# Altium project DE-120824.PrjPcb
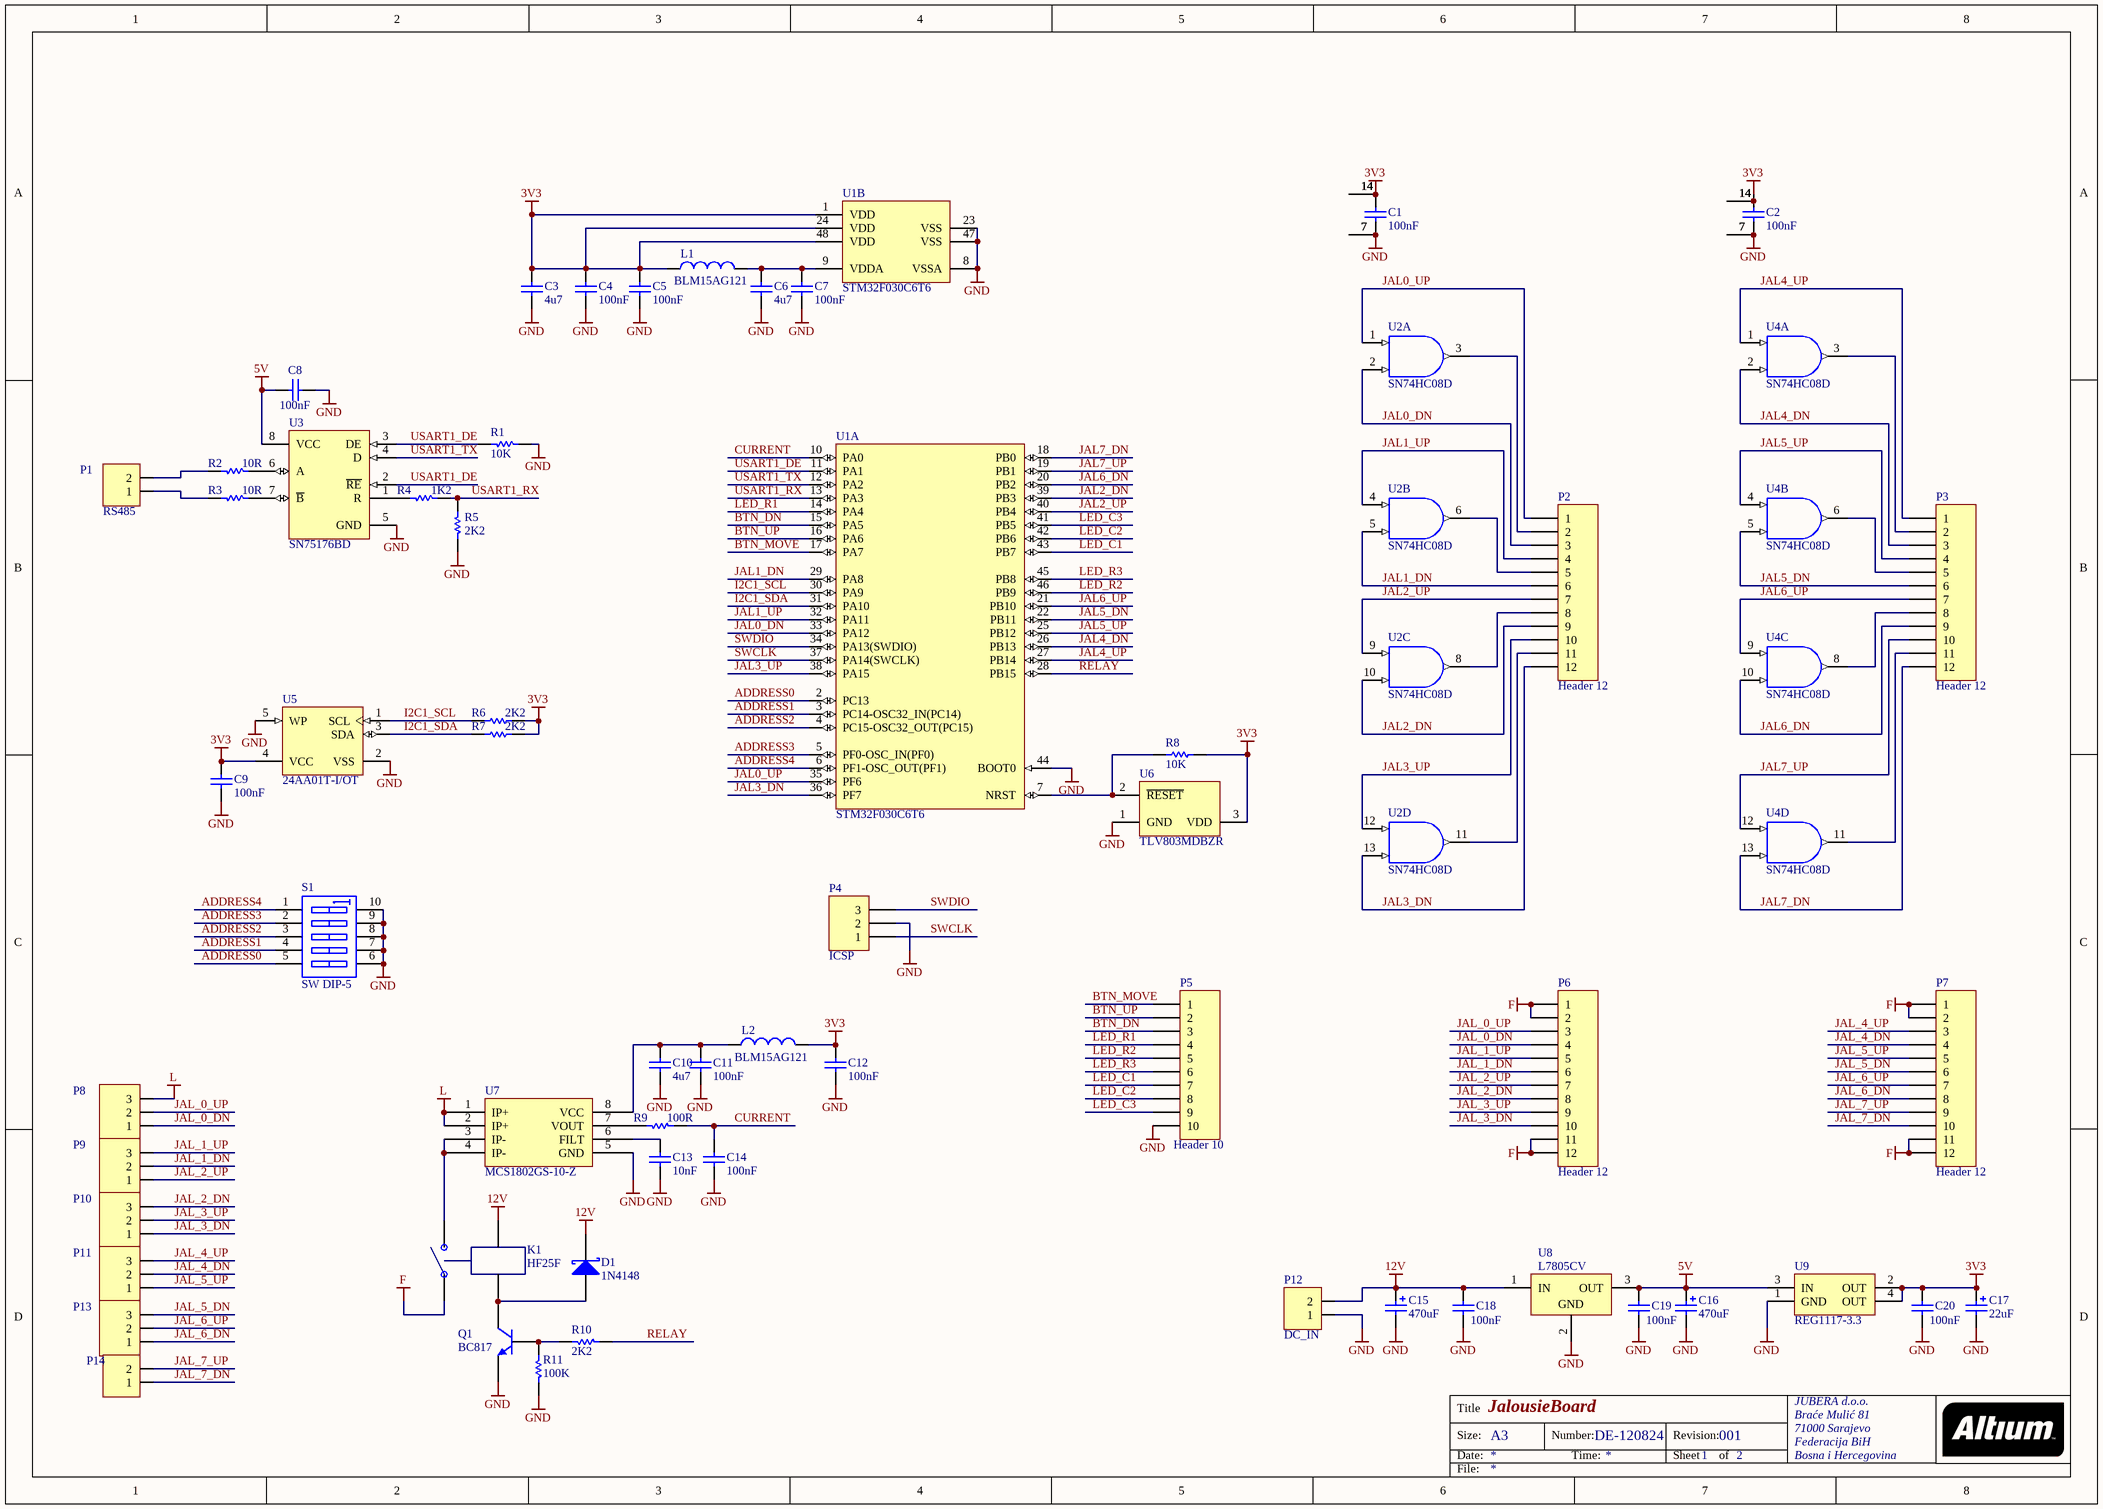
[diagram p0: DE-120824.SchDoc]
2 sheets, 163 parts. Net scope: global (net labels, ports and power ports of the same name join across sheets).
Board files: DE-120824.PcbDoc, DE-120824_1.PcbDoc
Sheets:
  DE-120824.SchDoc
  DE-120824_01.SchDoc

## Sheet DE-120824.SchDoc: JalousieBoard
size A3; Author: eldar6776@hotmail.com; DrawnBy: Eldar Dedic; Organization: JUBERA d.o.o.; Address1: Braće Mulić 81; Address2: 71000 Sarajevo; Address3: Federacija BiH; Address4: Bosna i Hercegovina; DocumentNumber: DE-120824; Revision: 001; SheetNumber: 1; SheetTotal: 2

### Parts
C1  value 100nF  [0603]  (hidden comment: C0603)
C2  value 100nF  [0603]  (hidden comment: C0603)
C3  value 4u7  [0805]  (hidden comment: C0805)
C4  value 100nF  [0603]  (hidden comment: C0603)
C5  value 100nF  [0603]  (hidden comment: C0603)
C6  value 4u7  [0805]  (hidden comment: C0805)
C7  value 100nF  [0603]  (hidden comment: C0603)
C8  100nF  [0603]
C9  value 100nF  [0603]  (hidden comment: C0603)
C10  value 4u7  [0805]  (hidden comment: C0805)
C11  value 100nF  [0603]  (hidden comment: C0603)
C12  value 100nF  [0603]  (hidden comment: C0603)
C13  value 10nF  [0603]  (hidden comment: C0603)
C14  value 100nF  [0603]  (hidden comment: C0603)
C15  470uF  [CAPPR5-10X12.5]
C16  470uF  [CAPPR5-10X12.5]
C17  22uF  [CAPPR2-5X11]
C18  100nF  [0603]
C19  100nF  [0603]
C20  100nF  [0603]
D1  1N4148  [SOD323]
K1  HF25F  [HF25F]
L1  BLM15AG121  [0402-A]
L2  BLM15AG121  [0402-A]
P1  RS485  [TERMINAL BLOK 2]
P2  Header 12  [HDR1X12]
P3  Header 12  [HDR1X12]
P4  ICSP  [HDR1X3]
P5  Header 10  [HDR1X10]
P6  Header 12  [HDR1X12]
P7  Header 12  [HDR1X12]
P8  (no value)  [TERMINAL BLOK 3]
P9  (no value)  [TERMINAL BLOK 3]
P10  (no value)  [TERMINAL BLOK 3]
P11  (no value)  [TERMINAL BLOK 3]
P12  DC_IN  [TERMINAL BLOK 2]
P13  (no value)  [TERMINAL BLOK 3]
P14  (no value)  [TERMINAL BLOK 2]
Q1  BC817  [SOT23_N]
R1  10K  [ERA-0603]
R2  10R  [ERA-0603]
R3  10R  [ERA-0603]
R4  1K2  [ERA-0603]
R5  2K2  [ERA-0603]
R6  2K2  [ERA-0603]
R7  2K2  [ERA-0603]
R8  10K  [ERA-0603]
R9  100R  [ERA-0603]
R10  2K2  [ERA-0603]
R11  100K  [ERA-0603]
S1  SW DIP-5  [N10A]
U1  STM32F030C6T6  [STM-LQFP48_N]  (parts A,B of 2)
U2  SN74HC08D  [D014_N]  (parts A,B,C,D of 4)
U3  SN75176BD  [D008_N]
U4  SN74HC08D  [D014_N]  (parts A,B,C,D of 4)
U5  24AA01T-I/OT  [SOT-23-OT5_N]
U6  TLV803MDBZR  [DBZ3_N]
U7  MCS1802GS-10-Z  [SOIC-SN8_N]
U8  L7805CV  [TO220]
U9  REG1117-3.3  [ZZ311]

### Nets
3V3: C1.1 C2.1 C3.2 C4.2 C5.2 C9.2 C12.2 C17.1 C20.2 L1.1 L2.2 R6.2 R7.2 R8.2 U1.1(VDD) U1.24(VDD) U1.48(VDD) U2.14(3V3) U5.4(VCC) U6.3(VDD) U9.2(OUT) U9.4(OUT)
5V: C8.1 C16.1 C19.2 U3.8(VCC) U8.3(OUT) U9.3(IN)
12V: C15.1 C18.2 D1.1(K) K1.2 P12.2 U8.1(IN)
F: K1.3 P6.1 P6.2 P6.11 P6.12 P7.1 P7.2 P7.11 P7.12
GND: C1.2 C2.2 C3.1 C4.1 C5.1 C6.1 C7.1 C8.2 C9.1 C10.1 C11.1 C12.1 C13.1 C14.1 C15.2 C16.2 C17.2 C18.1 C19.1 C20.1 P4.2 P5.10 P12.1 Q1.2(E) R1.1 R5.2 R11.1 S1.6(B5) S1.7(B4) S1.8(B3) S1.9(B2) S1.10(B1) U1.8(VSSA) U1.23(VSS) U1.44(BOOT0) U1.47(VSS) U2.7(GND) U3.5(GND) U4.7(GND) U5.2(VSS) U5.5(WP) U6.1(GND) U7.5(GND) U8.2(GND) U9.1(GND)
L: P8.3 U7.1(IP+) U7.2(IP+)
ADDRESS0: S1.5(A5) U1.2(PC13)
ADDRESS1: S1.4(A4) U1.3(PC14-OSC32_IN(PC14))
ADDRESS2: S1.3(A3) U1.4(PC15-OSC32_OUT(PC15))
ADDRESS3: S1.2(A2) U1.5(PF0-OSC_IN(PF0))
ADDRESS4: S1.1(A1) U1.6(PF1-OSC_OUT(PF1))
BTN_DN: P5.3 U1.15(PA5)
BTN_MOVE: P5.1 U1.17(PA7)
BTN_UP: P5.2 U1.16(PA6)
CURRENT: C14.2 R9.1 U1.10(PA0)
I2C1_SCL: R6.1 U1.30(PA9) U5.1(SCL)
I2C1_SDA: R7.1 U1.31(PA10) U5.3(SDA)
JAL0_DN: P2.3 U1.33(PA12) U2.2(B)
JAL0_UP: P2.1 U1.35(PF6) U2.1(A)
JAL1_DN: P2.6 U1.29(PA8) U2.5(B)
JAL1_UP: P2.4 U1.32(PA11) U2.4(A)
JAL2_DN: P2.9 U1.39(PB3) U2.10(B)
JAL2_UP: P2.7 U1.40(PB4) U2.9(A)
JAL3_DN: P2.12 U1.36(PF7) U2.13(B)
JAL3_UP: P2.10 U1.38(PA15) U2.12(A)
JAL4_DN: P3.3 U1.26(PB13) U4.2(B)
JAL4_UP: P3.1 U1.27(PB14) U4.1(A)
JAL5_DN: P3.6 U1.22(PB11) U4.5(B)
JAL5_UP: P3.4 U1.25(PB12) U4.4(A)
JAL6_DN: P3.9 U1.20(PB2) U4.10(B)
JAL6_UP: P3.7 U1.21(PB10) U4.9(A)
JAL7_DN: P3.12 U1.18(PB0) U4.13(B)
JAL7_UP: P3.10 U1.19(PB1) U4.12(A)
JAL_0_DN: P6.4 P8.1
JAL_0_UP: P6.3 P8.2
JAL_1_DN: P6.6 P9.2
JAL_1_UP: P6.5 P9.3
JAL_2_DN: P6.8 P10.3
JAL_2_UP: P6.7 P9.1
JAL_3_DN: P6.10 P10.1
JAL_3_UP: P6.9 P10.2
JAL_4_DN: P7.4 P11.2
JAL_4_UP: P7.3 P11.3
JAL_5_DN: P7.6 P13.3
JAL_5_UP: P7.5 P11.1
JAL_6_DN: P7.8 P13.1
JAL_6_UP: P7.7 P13.2
JAL_7_DN: P7.10 P14.1
JAL_7_UP: P7.9 P14.2
LED_C1: P5.7 U1.43(PB7)
LED_C2: P5.8 U1.42(PB6)
LED_C3: P5.9 U1.41(PB5)
LED_R1: P5.4 U1.14(PA4)
LED_R2: P5.5 U1.46(PB9)
LED_R3: P5.6 U1.45(PB8)
RELAY: R10.2 U1.28(PB15)
SWCLK: P4.1 U1.37(PA14(SWCLK))
SWDIO: P4.3 U1.34(PA13(SWDIO))
USART1_DE: R1.2 U1.11(PA1) U3.2(~{RE}) U3.3(DE)
USART1_RX: R4.1 R5.1 U1.13(PA3)
USART1_TX: U1.12(PA2) U3.4(D)
NetC6_2: C6.2 C7.2 L1.2 U1.9(VDDA)
NetC10_2: C10.2 C11.2 L2.1 U7.8(VCC)
NetC13_2: C13.2 U7.6(FILT)
NetD1_2: D1.2(A) K1.1 Q1.3(C)
NetK1_4: K1.4 U7.3(IP-) U7.4(IP-)
NetP1_1: P1.1 R3.1
NetP1_2: P1.2 R2.1
NetP2_2: P2.2 U2.3(Y)
NetP2_5: P2.5 U2.6(Y)
NetP2_8: P2.8 U2.8(Y)
NetP2_11: P2.11 U2.11(Y)
NetP3_2: P3.2 U4.3(Y)
NetP3_5: P3.5 U4.6(Y)
NetP3_8: P3.8 U4.8(Y)
NetP3_11: P3.11 U4.11(Y)
NetQ1_1: Q1.1(B) R10.1 R11.2
NetR2_2: R2.2 U3.6(A)
NetR3_2: R3.2 U3.7(~{B})
NetR4_2: R4.2 U3.1(R)
NetR8_1: R8.1 U1.7(NRST) U6.2(~{RESET})
NetR9_2: R9.2 U7.7(VOUT)

Not connected (* = marked no-connect by the designer): U4 14(3V3)

### Notes on the sheet
- Title
- Size:
- Date:
- A3
- Number:
- Time:
- Revision:
- Sheet
- of
- File:

### Library data of the parts
C1 C2 C4 C5 C7-C9 C11-C14 C18-C20 = C0603: Ceramic Chip Capacitor - Standard; Note: Footprint corresponds to dimensions for bulk cassette packaging. This case size has tightened tolerances.; Published: 17-Jul-2002; LatestRevisionDate: 19-Mar-2004; LatestRevisionNote: Silkscreen size reduced.; DatasheetDocument: Mar-2001; PackageDocument: Mar-2001; PackageReference: 0603; Publisher: Altium Limited; Code_JEITA: 0603; Code_IPC: 1608 [0603]; ComponentLink1Description: Manufacturer Link; ComponentLink1URL: http://www.kemet.com/; ComponentLink2Description: Datasheet; ComponentLink2URL: http://www.kemet.com/kemet/web/homepage/kechome.nsf/vapubfilesname/F3102TA.pdf/$file/F3102TA.pdf
  C8 C18-C20: Value: 100nF
C3 C6 C10 = C0805: Ceramic Chip Capacitor - Standard; Note: Footprint corresponds to dimensions for bulk cassette packaging. This case size has tightened tolerances.; Published: 17-Jul-2002; LatestRevisionDate: 19-Mar-2004; LatestRevisionNote: Silkscreen size reduced.; DatasheetDocument: Mar-2001; PackageDocument: Mar-2001; PackageReference: 0805; Publisher: Altium Limited; Code_JEITA: 0805; Code_IPC: 2012[0805]; ComponentLink1Description: Manufacturer Link; ComponentLink1URL: http://www.kemet.com/; ComponentLink2Description: Datasheet; ComponentLink2URL: http://www.kemet.com/kemet/web/homepage/kechome.nsf/vapubfilesname/F3102TA.pdf/$file/F3102TA.pdf
C15 C16 = EKA00DC347E00: Aluminum Electrolytic Capacitor, Radial Style with Long Leads: 470uF, 25V; Note: Refer to Manufacturer's Data Sheets for other lead formations; DrillSize: Nominal, Rounded To The Nearest 0.1mm; Published: 19-Mar-2004; DatasheetDocument: 20-Feb-2001; PackageReference: CAPPR5-10X12.5; Publisher: Altium Limited; ComponentLink1Description: Manufacturer Link; ComponentLink1URL: http://www.vishay.com/; ComponentLink2Description: Datasheet; ComponentLink2URL: http://www.vishay.com/docs/25014/eka.pdf; Value: 470uF
C17 = EKA00AA247F00: Aluminum Electrolytic Capacitor, Radial Style with Long Leads: 47uF, 35V; Note: Refer to Manufacturer's Data Sheets for other lead formations; DrillSize: Nominal, Rounded To The Nearest 0.1mm; Published: 19-Mar-2004; DatasheetDocument: 20-Feb-2001; PackageReference: CAPPR2-5X11; Publisher: Altium Limited; ComponentLink1Description: Manufacturer Link; ComponentLink1URL: http://www.vishay.com/; ComponentLink2Description: Datasheet; ComponentLink2URL: http://www.vishay.com/docs/25014/eka.pdf; Value: 47uF
D1 = 1PS76SB10: Schottky Barrier Diode; Published: 17-Sep-2003; LatestRevisionDate: 19-Mar-2004; LatestRevisionNote: Silkscreen size reduced.; DatasheetVersion: 14-Oct-1996; PackageVersion: May-1999; PackageReference: SOD323; Publisher: Altium Limited; PackageDescription: SOD-323/SC-76; 2 Leads; Body 1.7 x 1.3 mm, (LxW); ComponentLink1Description: Manufacturer Link; ComponentLink1URL: http://www.semiconductors.philips.com/; ComponentLink2Description: Datasheet; ComponentLink2URL: http://www.semiconductors.philips.com/acrobat/datasheets/1PS76SB10_2.pdf
K1 = HF25F: PCB relay 250VAC/20A 30VDC/16A
L1 L2 = Chip inductor: SMD chip inductor; Code_IEC: 1005; Published: 8-Jun-2000; LatestRevisionDate: 29-May-2009; LatestRevisionNote: IPC-7351 Footprint Added.; PackageReference: 0402-A; Publisher: Altium Limited; PackageDescription: Chip Inductor; Code_JEITA: 0402
P1 P12 P14 = TERMINAL BLOK 2: Terminal blok konektor 3,5 mm
P2 P3 P6 P7 = Header 12: Header, 12-Pin; LatestRevisionDate: 17-Jul-2002; LatestRevisionNote: Re-released for DXP Platform.; Publisher: Altium Limited
P4 = Header 3: Header, 3-Pin; LatestRevisionDate: 17-Jul-2002; LatestRevisionNote: Re-released for DXP Platform.; Publisher: Altium Limited
P5 = Header 10: Header, 10-Pin; LatestRevisionDate: 17-Jul-2002; LatestRevisionNote: Re-released for DXP Platform.; Publisher: Altium Limited
P8-P11 P13 = TERMINAL BLOK 3: 3 pinski terminal blok konektor
Q1 = BC817: NPN General-purpose Transistor; Published: 17-Sep-2003; LatestRevisionDate: 12-Dec-2006; LatestRevisionNote: IPC-7351 Footprint Added.; DatasheetVersion: Jun-1999; PackageVersion: May-1999; PackageReference: SOT23; Publisher: Altium Limited; PackageDescription: 3-Pin SOT-23 Package 0.95 mm Pitch, 2.3 mm Lead Span; ComponentLink1Description: Manufacturer Link; ComponentLink1URL: http://www.semiconductors.philips.com/; ComponentLink2Description: Datasheet; ComponentLink2URL: http://www.semiconductors.philips.com/acrobat/datasheets/BC817_BC817W_BC337_5.pdf
R1-R5 R9-R11 = ERAV: Metal Film Thermosensitive Chip Resistor, 0.56 Ohm to 10k Ohm Range, 5% Tolerance, 0603 Size, 0.063 W; Note: If flow soldering, adjust pad width of PCB Footprint to 0.7 - 0.8 times the width of the resistor.; Published: 17-Dec-2003; LatestRevisionDate: 19-Mar-2004; LatestRevisionNote: Silkscreen size reduced.; PackageDocument: Mar-2003; PackageReference: ERA-0603; Publisher: Altium Limited; Code_IPC: 1608 [0603]; ComponentLink1Description: Manufacturer Link; ComponentLink1URL: http://www.panasonic.com/industrial/components/resistive_products.htm; ComponentLink2Description: Datasheet; ComponentLink2URL: http://www.panasonic.com/industrial/components/pdf/AOF0000CE1.pdf
R6-R8 = ERA3Y: Rectangular Thick Film Chip Resistor, 10 Ohm to 330k Ohm Range, 0.1% and 0.5% Tolerance, 0603 Size, 0.063 W; Note: If flow soldering, adjust pad width of PCB Footprint to 0.7 - 0.8 times the width of the resistor.; Published: 17-Dec-2003; LatestRevisionDate: 19-Mar-2004; LatestRevisionNote: Silkscreen size reduced.; PackageDocument: Mar-2003; PackageReference: ERA-0603; Publisher: Altium Limited; Code_IPC: 1608 [0603]; ComponentLink1Description: Manufacturer Link; ComponentLink1URL: http://www.panasonic.com/industrial/components/resistive_products.htm; ComponentLink2Description: Datasheet; ComponentLink2URL: http://www.panasonic.com/industrial/components/pdf/AOA0000CE8.pdf
S1 = SW DIP-5: DIP Switch, 5 Position, SPST; Published: 24-Mar-1999; LatestRevisionDate: 17-Jul-2002; LatestRevisionNote: Re-released for DXP Platform.; PackageReference: N10A; Publisher: Altium Limited
U1 = STM32F030C6T6: ARM Cortex-M0 32-bit MCU, 32 KB Flash, 4 KB Internal RAM, 39 I/Os, 48-pin LQFP, -40 to 85 degC, Tray; FLASH Size (Prog) (kB): 32; I/Os (High Current): 39; Internal RAM Size (kB): 4; Operating Frequency(F) (Processor speed) (MHz): 48; Supply Voltage(Vcc) min (V): 2.4; DatasheetVersion: Rev. 1; PackageVersion: Rev. 6, 06/2013; PackageReference: LQFP48; PackageDescription: 48-Pin Low Profile Quad Flat Package, 7 x 7 mm Body, 0.5 mm Pitch; Supplier 1: Digi-Key; Supplier Part Number 1: 497-14042-ND; Supplier 2: Newark; Supplier Part Number 2: 06X3646; Supplier 3: Mouser; Supplier Part Number 3: 511-STM32F030C6T6; Core: ARM Cortex-M0; Packing: Tray; Mounting Technology: Surface Mount; PartNumber: STM32F030C6T6; ComponentLink1Description: Manufacturer URL; ComponentLink1URL: http://www.st.com/web/en/home.html; ComponentLink2Description: Datasheet; ComponentLink2URL: http://www.st.com/st-web-ui/static/active/en/resource/technical/document/datasheet/DM00088500.pdf; ComponentLink3Description: Package Specification; ComponentLink3URL: http://www.st.com/st-web-ui/static/active/en/resource/technical/document/datasheet/DM00058181.pdf
U2 U4 = SN74HC08D: Quadruple 2-Input Positive-AND Gate; Published: 8-Jun-2000; LatestRevisionDate: 13-Apr-2006; LatestRevisionNote: IPC-7351 Footprint Added.; DatasheetVersion: May-1997; PackageVersion: Jan-1998; PackageReference: D014; Publisher: Altium Limited; PackageDescription: 14-Pin Small Outline Integrated Circuit 1.27 mm Pitch; Code_IPC: SOIC127P600-14; ComponentLink1Description: Manufacturer Link; ComponentLink1URL: http://www.ti.com/; ComponentLink2Description: Datasheet; ComponentLink2URL: http://www-s.ti.com/sc/ds/SN74HC08.pdf
U3 = SN75176BD: Differential Bus Transceiver; Note: Receiver Hysteresis of 50mV Typical; Published: 15-May-2002; LatestRevisionDate: 13-Apr-2006; LatestRevisionNote: IPC-7351 Footprint Added.; DatasheetVersion: Sep-1989; PackageVersion: Jan-1998; PackageReference: D008; Publisher: Altium Limited; PackageDescription: 8-Pin Small Outline Integrated Circuit 1.27 mm Pitch; Code_IPC: SOIC127P600-8; ComponentLink1Description: Manufacturer Link; ComponentLink1URL: http://www.ti.com/; ComponentLink2Description: Datasheet; ComponentLink2URL: http://www-s.ti.com/sc/ds/sn75176b.pdf
U5 = 24AA01T-I/OT: 1Kbit, 400kHz, 1.8V, I2C Serial EEPROM, 5-Pin SOT-23, Industrial Temperature, Tape and Reel; Published: 29-Jan-2009; DatasheetVersion: revJ, Jan-2009; PackageVersion: revBB, Aug-2009; PackageReference: SOT-23-OT5; Publisher: Altium Limited; PackageDescription: 5-Lead Plastic Small Outline Transistor (OT) [SOT-23]; Supplier 1: Digi-Key; Supplier Part Number 1: 24AA01T-I/OTTR-ND; Supplier 2: Digi-Key; Supplier Part Number 2: 24AA01T-I/OTCT-ND; Supplier 3: Digi-Key; Supplier Part Number 3: 24AA01T-I/OTDKR-ND; Supplier 4: Farnell; Supplier Part Number 4: 1331269; Code_IPC: SOT23-5; ComponentLink1Description: Datasheet; ComponentLink1URL: http://ww1.microchip.com/downloads/en/DeviceDoc/21711J.pdf; ComponentLink2Description: Packaging Specification; ComponentLink2URL: http://www.microchip.com/stellent/groups/techpub_sg/documents/packagingspec/en012702.pdf; ComponentLink3Description: Microchip.com Home; ComponentLink3URL: http://www.microchip.com/
U6 = TLV803MDBZR: Voltage Supervisor with Active-Low, Open Drain Reset, 1 Supply Monitored, -40 to 125 degC, 3-pin SOT-23 (DBZ), Green (RoHS & no Sb/Br); Manufacturer: Texas Instruments; # of supplies monitored: 1; Iq(Typ)(uA): 9; Output Driver Type / Reset Output: Active-low, Open-drain; Rating: Catalog; Reset Threshold Accuracy(%): 2; SubFamily: Supervisor and Reset IC; Threshold Voltage 1 (typ)(Typ)(V): 4.38; Time Delay(ms): 200; VCC(Max)(V): 6; VCC(Min)(V): 1.1; DatasheetVersion: SBVS157B; PackageVersion: revB, Apr-2005; PackageReference: DBZ3; PackageDescription: 3-Pin Plastic Small-Outline Package, 0.95 mm Pitch, 2.4 mm Lead Span; Supplier 1: Digi-Key; Supplier Part Number 1: 296-29194-2-ND; Supplier 2: Digi-Key; Supplier Part Number 2: 296-29194-1-ND; Supplier 3: Digi-Key; Supplier Part Number 3: 296-29194-6-ND; Supplier 4: Newark; Supplier Part Number 4: 58T0286; Supplier 5: Mouser; Supplier Part Number 5: 595-TLV803MDBZR; Mounting Technology: Surface Mount; Code_JEDEC: TO-236-AB; PartNumber: TLV803MDBZR; ComponentLink1Description: Datasheet; ComponentLink1URL: http://www.ti.com/general/docs/lit/getliterature.tsp?genericPartNumber=TLV803M&fileType=pdf
U7 = ACS71240
U8 = L7805CV: Positive Voltage Regulator, 5V, 3-Pin TO-220; DatasheetVersion: Nov-2011; PackageVersion: ver3.0; PackageReference: TO220; PackageDescription: TO, Thru-Hole, Vertical, Heatsink Mounted; 3 In-Line Leads; Pitch 2.54 mm; PartNumber: L7805CV; ComponentLink1Description: Manufacturer URL; ComponentLink1URL: http://www.st.com; ComponentLink2Description: Datasheet; ComponentLink2URL: http://www.st.com/internet/com/TECHNICAL_RESOURCES/TECHNICAL_LITERATURE/DATASHEET/CD00000444.pdf; ComponentLink3Description: Package Specification; ComponentLink3URL: http://www.st.com/internet/com/TECHNICAL_RESOURCES/TECHNICAL_LITERATURE/PACKAGE_INFORMATION/CD00004649.pdf
U9 = REG1117-3.3: 800mA and 1A Low Dropout Positive Regulator 2.85V, 3.3V, 5V, and Adjustable; Published: 8-Jun-2000; LatestRevisionDate: 17-Jul-2002; LatestRevisionNote: Re-released for DXP Platform.; DatasheetVersion: Sep-1997; PackageVersion: revC; PackageReference: ZZ311; Publisher: Altium Limited; PackageDescription: SOT-223/SC-73; 4 Leads; Body 6.7 x 7.3 mm, inc. leads (LxW max); ComponentLink1Description: Manufacturer Link; ComponentLink1URL: http://www.ti.com/; ComponentLink2Description: Datasheet; ComponentLink2URL: http://www-s.ti.com/sc/ds/REG1117.pdf

## Sheet DE-120824_01.SchDoc: JalousieBoard
size A3; Author: eldar6776@hotmail.com; DrawnBy: Eldar Dedic; Organization: JUBERA d.o.o.; Address1: Braće Mulić 81; Address2: 71000 Sarajevo; Address3: Federacija BiH; Address4: Bosna i Hercegovina; DocumentNumber: DE-120824; Revision: 001; SheetNumber: 1; SheetTotal: 2
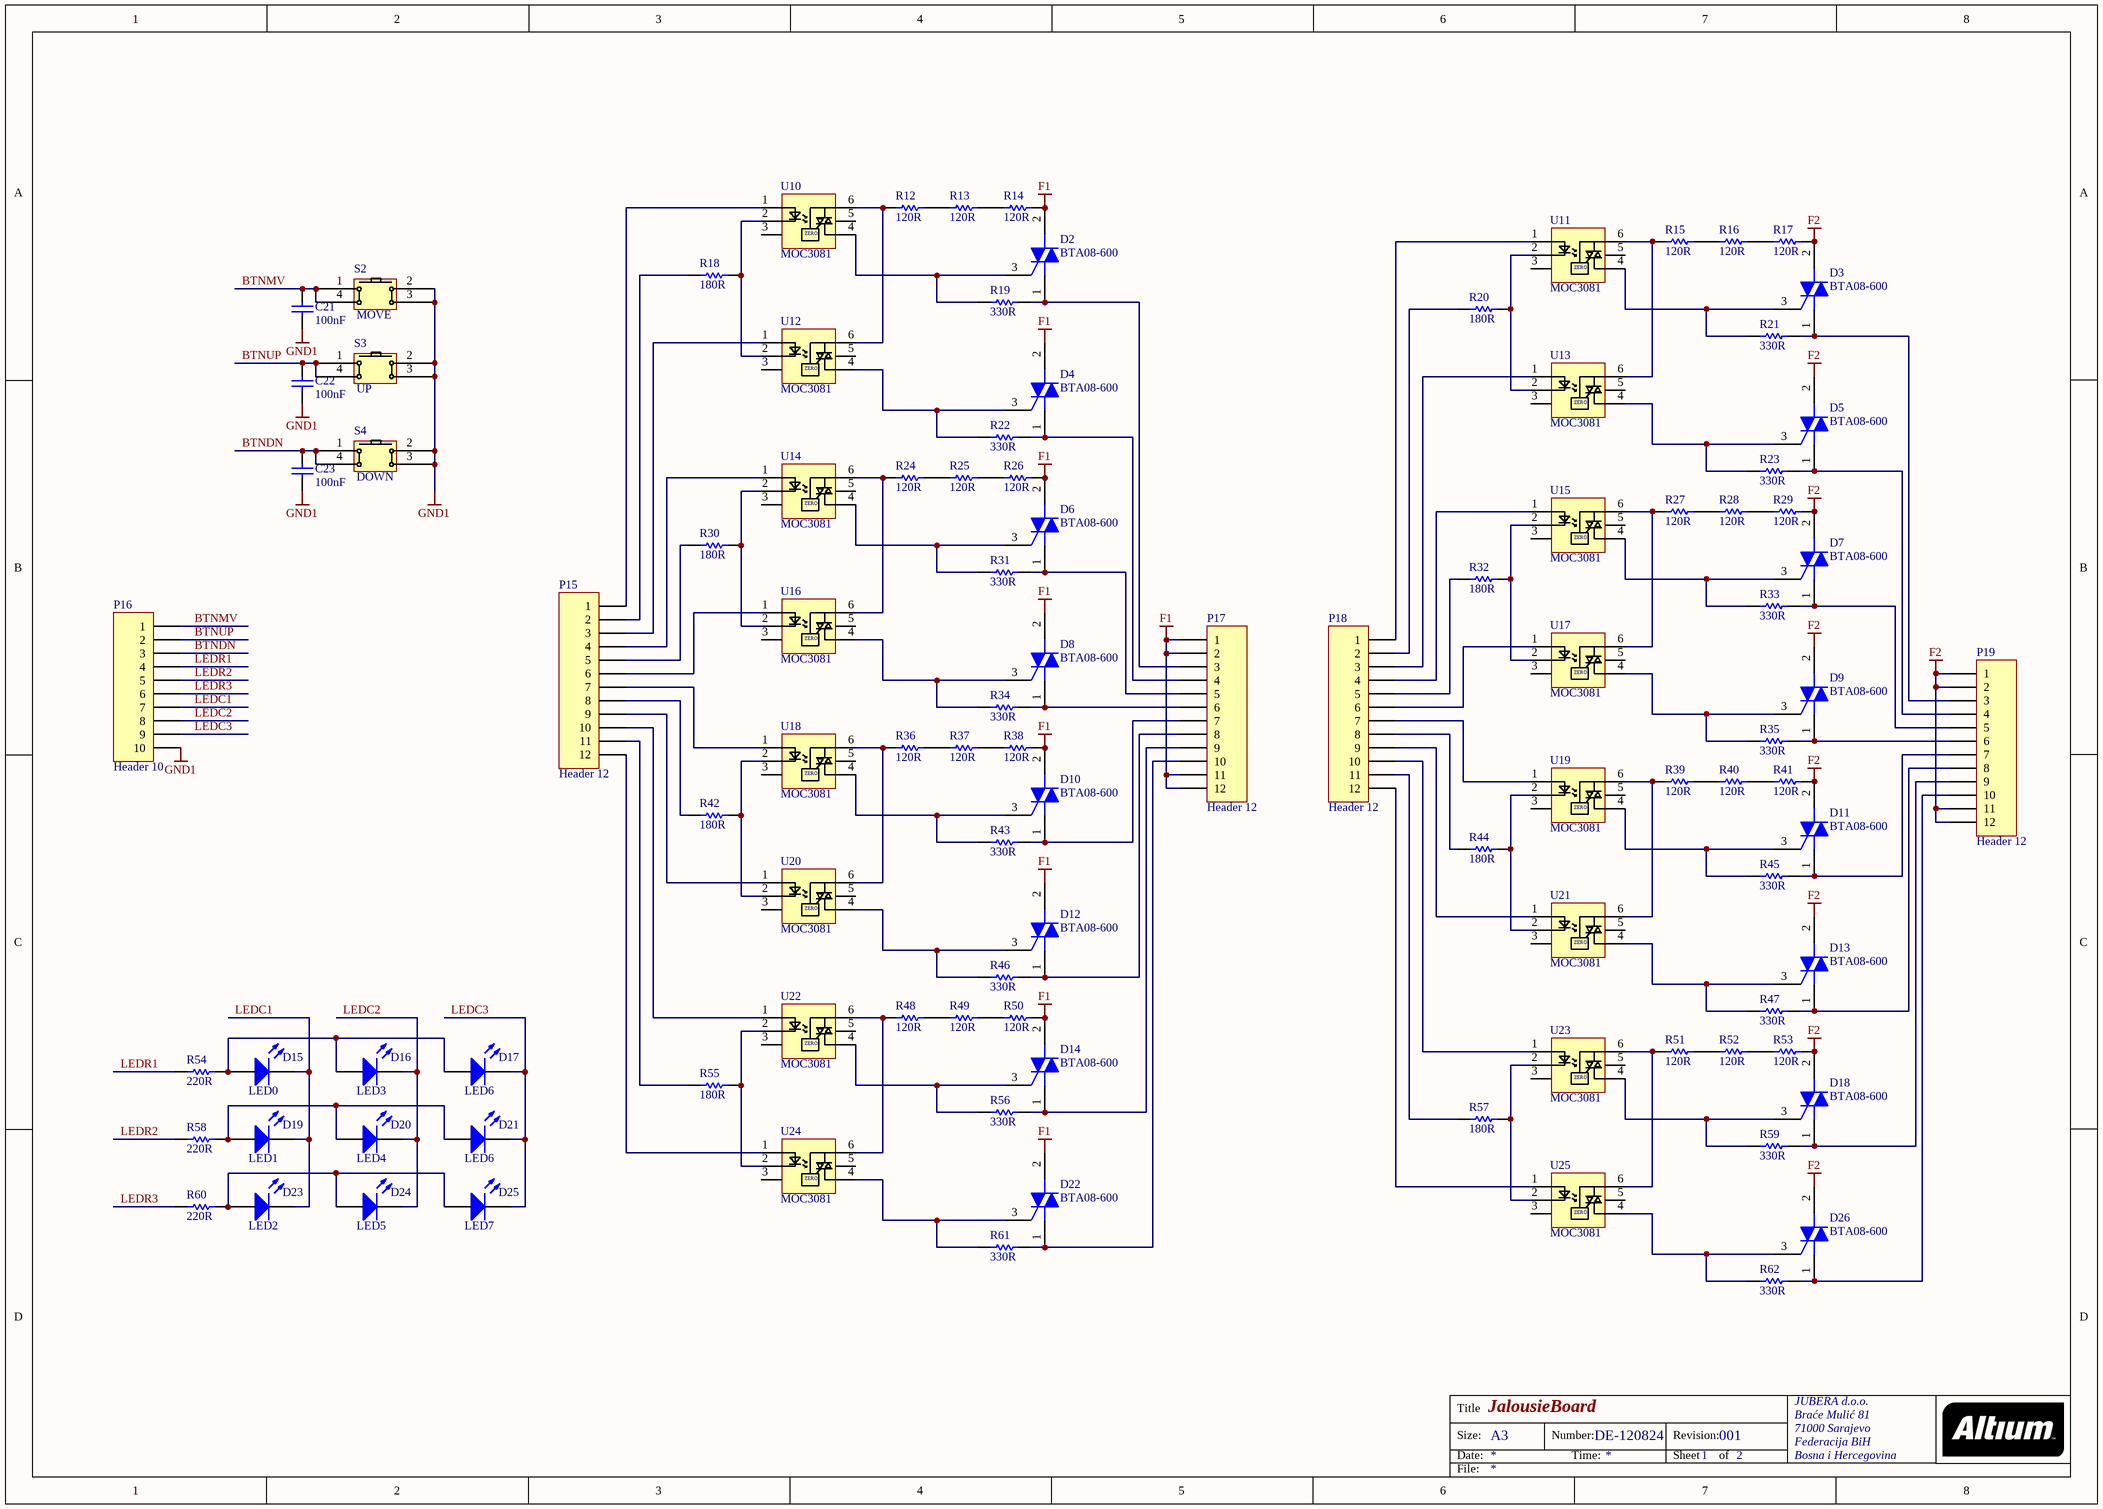
[diagram p1: DE-120824_01.SchDoc]

### Parts
C21  value 100nF  [0603]  (hidden comment: C0603)
C22  value 100nF  [0603]  (hidden comment: C0603)
C23  value 100nF  [0603]  (hidden comment: C0603)
D2  BTA08-600  [ONSC-TO-220-3-221A-07]
D3  BTA08-600  [ONSC-TO-220-3-221A-07]
D4  BTA08-600  [ONSC-TO-220-3-221A-07]
D5  BTA08-600  [ONSC-TO-220-3-221A-07]
D6  BTA08-600  [ONSC-TO-220-3-221A-07]
D7  BTA08-600  [ONSC-TO-220-3-221A-07]
D8  BTA08-600  [ONSC-TO-220-3-221A-07]
D9  BTA08-600  [ONSC-TO-220-3-221A-07]
D10  BTA08-600  [ONSC-TO-220-3-221A-07]
D11  BTA08-600  [ONSC-TO-220-3-221A-07]
D12  BTA08-600  [ONSC-TO-220-3-221A-07]
D13  BTA08-600  [ONSC-TO-220-3-221A-07]
D14  BTA08-600  [ONSC-TO-220-3-221A-07]
D15  LED0  [1.6X0.8X0.8]
D16  LED3  [1.6X0.8X0.8]
D17  LED6  [1.6X0.8X0.8]
D18  BTA08-600  [ONSC-TO-220-3-221A-07]
D19  LED1  [1.6X0.8X0.8]
D20  LED4  [1.6X0.8X0.8]
D21  LED6  [1.6X0.8X0.8]
D22  BTA08-600  [ONSC-TO-220-3-221A-07]
D23  LED2  [1.6X0.8X0.8]
D24  LED5  [1.6X0.8X0.8]
D25  LED7  [1.6X0.8X0.8]
D26  BTA08-600  [ONSC-TO-220-3-221A-07]
P15  Header 12  [HDR1X12]
P16  Header 10  [HDR1X10]
P17  Header 12  [HDR1X12]
P18  Header 12  [HDR1X12]
P19  Header 12  [HDR1X12]
R12  120R  [ERA-0805]
R13  120R  [ERA-0805]
R14  120R  [ERA-0805]
R15  120R  [ERA-0805]
R16  120R  [ERA-0805]
R17  120R  [ERA-0805]
R18  180R  [ERA-0603]
R19  330R  [ERA-0805]
R20  180R  [ERA-0603]
R21  330R  [ERA-0805]
R22  330R  [ERA-0805]
R23  330R  [ERA-0805]
R24  120R  [ERA-0805]
R25  120R  [ERA-0805]
R26  120R  [ERA-0805]
R27  120R  [ERA-0805]
R28  120R  [ERA-0805]
R29  120R  [ERA-0805]
R30  180R  [ERA-0603]
R31  330R  [ERA-0805]
R32  180R  [ERA-0603]
R33  330R  [ERA-0805]
R34  330R  [ERA-0805]
R35  330R  [ERA-0805]
R36  120R  [ERA-0805]
R37  120R  [ERA-0805]
R38  120R  [ERA-0805]
R39  120R  [ERA-0805]
R40  120R  [ERA-0805]
R41  120R  [ERA-0805]
R42  180R  [ERA-0603]
R43  330R  [ERA-0805]
R44  180R  [ERA-0603]
R45  330R  [ERA-0805]
R46  330R  [ERA-0805]
R47  330R  [ERA-0805]
R48  120R  [ERA-0805]
R49  120R  [ERA-0805]
R50  120R  [ERA-0805]
R51  120R  [ERA-0805]
R52  120R  [ERA-0805]
R53  120R  [ERA-0805]
R54  220R  [ERA-0805]
R55  180R  [ERA-0603]
R56  330R  [ERA-0805]
R57  180R  [ERA-0603]
R58  220R  [ERA-0805]
R59  330R  [ERA-0805]
R60  220R  [ERA-0805]
R61  330R  [ERA-0805]
R62  330R  [ERA-0805]
S2  MOVE  [TACTILE_SWITCH]
S3  UP  [TACTILE_SWITCH]
S4  DOWN  [TACTILE_SWITCH]
U10  MOC3081  [DIP6]
U11  MOC3081  [DIP6]
U12  MOC3081  [DIP6]
U13  MOC3081  [DIP6]
U14  MOC3081  [DIP6]
U15  MOC3081  [DIP6]
U16  MOC3081  [DIP6]
U17  MOC3081  [DIP6]
U18  MOC3081  [DIP6]
U19  MOC3081  [DIP6]
U20  MOC3081  [DIP6]
U21  MOC3081  [DIP6]
U22  MOC3081  [DIP6]
U23  MOC3081  [DIP6]
U24  MOC3081  [DIP6]
U25  MOC3081  [DIP6]

### Nets
F1: D2.2(MT2) D4.2(MT2) D6.2(MT2) D8.2(MT2) D10.2(MT2) D12.2(MT2) D14.2(MT2) D22.2(MT2) P17.1 P17.2 P17.11 P17.12 R14.2 R26.2 R38.2 R50.2
F2: D3.2(MT2) D5.2(MT2) D7.2(MT2) D9.2(MT2) D11.2(MT2) D13.2(MT2) D18.2(MT2) D26.2(MT2) P19.1 P19.2 P19.11 P19.12 R17.2 R29.2 R41.2 R53.2
GND1: C21.2 C22.2 C23.2 P16.10 S2.2 S2.3 S3.2 S3.3 S4.2 S4.3
BTNDN: C23.1 P16.3 S4.1 S4.4
BTNMV: C21.1 P16.1 S2.1 S2.4
BTNUP: C22.1 P16.2 S3.1 S3.4
LEDC1: D15.2(K) D19.2(K) D23.2(K) P16.7
LEDC2: D16.2(K) D20.2(K) D24.2(K) P16.8
LEDC3: D17.2(K) D21.2(K) D25.2(K) P16.9
LEDR1: P16.4 R54.1
LEDR2: P16.5 R58.1
LEDR3: P16.6 R60.1
NetD2_1: D2.1(MT1) P17.3 R19.2
NetD2_3: D2.3(G) R19.1 U10.4
NetD3_1: D3.1(MT1) P19.3 R21.2
NetD3_3: D3.3(G) R21.1 U11.4
NetD4_1: D4.1(MT1) P17.4 R22.2
NetD4_3: D4.3(G) R22.1 U12.4
NetD5_1: D5.1(MT1) P19.4 R23.2
NetD5_3: D5.3(G) R23.1 U13.4
NetD6_1: D6.1(MT1) P17.5 R31.2
NetD6_3: D6.3(G) R31.1 U14.4
NetD7_1: D7.1(MT1) P19.5 R33.2
NetD7_3: D7.3(G) R33.1 U15.4
NetD8_1: D8.1(MT1) P17.6 R34.2
NetD8_3: D8.3(G) R34.1 U16.4
NetD9_1: D9.1(MT1) P19.6 R35.2
NetD9_3: D9.3(G) R35.1 U17.4
NetD10_1: D10.1(MT1) P17.7 R43.2
NetD10_3: D10.3(G) R43.1 U18.4
NetD11_1: D11.1(MT1) P19.7 R45.2
NetD11_3: D11.3(G) R45.1 U19.4
NetD12_1: D12.1(MT1) P17.8 R46.2
NetD12_3: D12.3(G) R46.1 U20.4
NetD13_1: D13.1(MT1) P19.8 R47.2
NetD13_3: D13.3(G) R47.1 U21.4
NetD14_1: D14.1(MT1) P17.9 R56.2
NetD14_3: D14.3(G) R56.1 U22.4
NetD15_1: D15.1(A) D16.1(A) D17.1(A) R54.2
NetD18_1: D18.1(MT1) P19.9 R59.2
NetD18_3: D18.3(G) R59.1 U23.4
NetD19_1: D19.1(A) D20.1(A) D21.1(A) R58.2
NetD22_1: D22.1(MT1) P17.10 R61.2
NetD22_3: D22.3(G) R61.1 U24.4
NetD23_1: D23.1(A) D24.1(A) D25.1(A) R60.2
NetD26_1: D26.1(MT1) P19.10 R62.2
NetD26_3: D26.3(G) R62.1 U25.4
NetP15_1: P15.1 U10.1
NetP15_2: P15.2 R18.1
NetP15_3: P15.3 U12.1
NetP15_4: P15.4 U14.1
NetP15_5: P15.5 R30.1
NetP15_6: P15.6 U16.1
NetP15_7: P15.7 U18.1
NetP15_8: P15.8 R42.1
NetP15_9: P15.9 U20.1
NetP15_10: P15.10 U22.1
NetP15_11: P15.11 R55.1
NetP15_12: P15.12 U24.1
NetP18_1: P18.1 U11.1
NetP18_2: P18.2 R20.1
NetP18_3: P18.3 U13.1
NetP18_4: P18.4 U15.1
NetP18_5: P18.5 R32.1
NetP18_6: P18.6 U17.1
NetP18_7: P18.7 U19.1
NetP18_8: P18.8 R44.1
NetP18_9: P18.9 U21.1
NetP18_10: P18.10 U23.1
NetP18_11: P18.11 R57.1
NetP18_12: P18.12 U25.1
NetR12_1: R12.1 U10.6 U12.6
NetR12_2: R12.2 R13.1
NetR13_2: R13.2 R14.1
NetR15_1: R15.1 U11.6 U13.6
NetR15_2: R15.2 R16.1
NetR16_2: R16.2 R17.1
NetR18_2: R18.2 U10.2 U12.2
NetR20_2: R20.2 U11.2 U13.2
NetR24_1: R24.1 U14.6 U16.6
NetR24_2: R24.2 R25.1
NetR25_2: R25.2 R26.1
NetR27_1: R27.1 U15.6 U17.6
NetR27_2: R27.2 R28.1
NetR28_2: R28.2 R29.1
NetR30_2: R30.2 U14.2 U16.2
NetR32_2: R32.2 U15.2 U17.2
NetR36_1: R36.1 U18.6 U20.6
NetR36_2: R36.2 R37.1
NetR37_2: R37.2 R38.1
NetR39_1: R39.1 U19.6 U21.6
NetR39_2: R39.2 R40.1
NetR40_2: R40.2 R41.1
NetR42_2: R42.2 U18.2 U20.2
NetR44_2: R44.2 U19.2 U21.2
NetR48_1: R48.1 U22.6 U24.6
NetR48_2: R48.2 R49.1
NetR49_2: R49.2 R50.1
NetR51_1: R51.1 U23.6 U25.6
NetR51_2: R51.2 R52.1
NetR52_2: R52.2 R53.1
NetR55_2: R55.2 U22.2 U24.2
NetR57_2: R57.2 U23.2 U25.2

Not connected (* = marked no-connect by the designer): U10 3 5; U11 3 5; U12 3 5; U13 3 5; U14 3 5; U15 3 5; U16 3 5; U17 3 5; U18 3 5; U19 3 5; U20 3 5; U21 3 5; U22 3 5; U23 3 5; U24 3 5; U25 3 5

### Notes on the sheet
- Title
- Size:
- Date:
- A3
- Number:
- Time:
- Revision:
- Sheet
- of
- File:
- (in symbol MOC3081) ZERO

### Library data of the parts
C21-C23 = C0603: as C1 on sheet DE-120824; Published: 17-Jul-2002; LatestRevisionDate: 19-Mar-2004; LatestRevisionNote: Silkscreen size reduced.; DatasheetDocument: Mar-2001; PackageDocument: Mar-2001; PackageReference: 0603; Publisher: Altium Limited; Code_JEITA: 0603; Code_IPC: 1608 [0603]; ComponentLink1Description: Manufacturer Link; ComponentLink1URL: http://www.kemet.com/; ComponentLink2Description: Datasheet; ComponentLink2URL: http://www.kemet.com/kemet/web/homepage/kechome.nsf/vapubfilesname/F3102TA.pdf/$file/F3102TA.pdf
D2-D14 D18 D22 D26 = BTA08-600BW3G: Triacs, Silicon Bidirectional Thyristor, 3-Pin TO-220, Pb-Free, Tube; Manufacturer: On Semiconductor; IGT Max (mA): 50; IT(RMS) Max (A): 8; ITSM Max (A): 90; DatasheetVersion: Rev. 1; PackageVersion: Rev. O, 07/2008; PackageReference: TO-220-3-221A-07; PackageDescription: 3-Pin Flange Mount, Vertical Straight Lead, Body 9.97 x 4.445 mm, Pitch 2.54 mm; Supplier 1: Digi-Key; Supplier Part Number 1: BTA08-600BW3G-ND; Supplier 2: Newark; Supplier Part Number 2: 13P2072; Supplier 3: Mouser; Supplier Part Number 3: 863-BTA08-600BW3G; Packing: Tube; RoHS: Pb-Free; Mounting Technology: Through Hole; PartNumber: BTA08-600BW3G; ComponentLink1Description: Manufacturer URL; ComponentLink1URL: http://www.onsemi.com/; ComponentLink2Description: Datasheet; ComponentLink2URL: http://www.onsemi.com/pub_link/Collateral/BTA08-600BW3-D.PDF; ComponentLink3Description: Package Specification; ComponentLink3URL: http://www.onsemi.com/pub_link/Collateral/221A-07.PDF
D15-D17 D19-D21 D23-D25 = HSMB-C190: Blue Surface Mount Chip LED, Blue; LuminousIntensity: 1.6mcd (Minimum).; PCB_Layout: Complies with manufacturer's recommendation.; Published: 11-Dec-2002; DatasheetVersion: 26-Feb-2002; PackageVersion: Mar-2002; PackageReference: 1.6X0.8X0.8; Publisher: Altium Limited; PackageDescription: SM LED; 2 Flat Leads; LED_Colour: Blue; ComponentLink1Description: Manufacturer Link; ComponentLink1URL: http://www.avagotech.com/; ComponentLink2Description: Datasheet; ComponentLink2URL: http://cp.literature.agilent.com/litweb/pdf/5988-5211EN.pdf
P15 P17-P19 = Header 12: Header, 12-Pin; LatestRevisionDate: 17-Jul-2002; LatestRevisionNote: Re-released for DXP Platform.; Publisher: Altium Limited
P16 = Header 10: Header, 10-Pin; LatestRevisionDate: 17-Jul-2002; LatestRevisionNote: Re-released for DXP Platform.; Publisher: Altium Limited
R12-R17 R19 R21-R29 R31 R33-R41 R43 R45-R54 R56 R58-R62 = ERAS: Metal Film Thermosensitive Chip Resistor, 0.56 Ohm to 10k Ohm Range, 5% Tolerance, 0805 Size, 0.1 W; Note: If flow soldering, adjust pad width of PCB Footprint to 0.7 - 0.8 times the width of the resistor.; Published: 17-Dec-2003; LatestRevisionDate: 19-Mar-2004; LatestRevisionNote: Silkscreen size reduced.; PackageDocument: Mar-2003; PackageReference: ERA-0805; Publisher: Altium Limited; Code_IPC: 2012 [0805]; ComponentLink1Description: Manufacturer Link; ComponentLink1URL: http://www.panasonic.com/industrial/components/resistive_products.htm; ComponentLink2Description: Datasheet; ComponentLink2URL: http://www.panasonic.com/industrial/components/pdf/AOF0000CE1.pdf
R18 R20 R30 R32 R42 R44 R55 R57 = ERA3Y: as R6 on sheet DE-120824; Published: 17-Dec-2003; LatestRevisionDate: 19-Mar-2004; LatestRevisionNote: Silkscreen size reduced.; PackageDocument: Mar-2003; PackageReference: ERA-0603; Publisher: Altium Limited; Code_IPC: 1608 [0603]; ComponentLink1Description: Manufacturer Link; ComponentLink1URL: http://www.panasonic.com/industrial/components/resistive_products.htm; ComponentLink2Description: Datasheet; ComponentLink2URL: http://www.panasonic.com/industrial/components/pdf/AOA0000CE8.pdf
S2-S4 = TACKTILE_SWITCH
U10-U25 = MOC3081: Zero-Cross Optoisolator Triac Driver